# EAGLE design STM32F413CG (EAGLE 9.2.0)

## Sheet 1 of 3
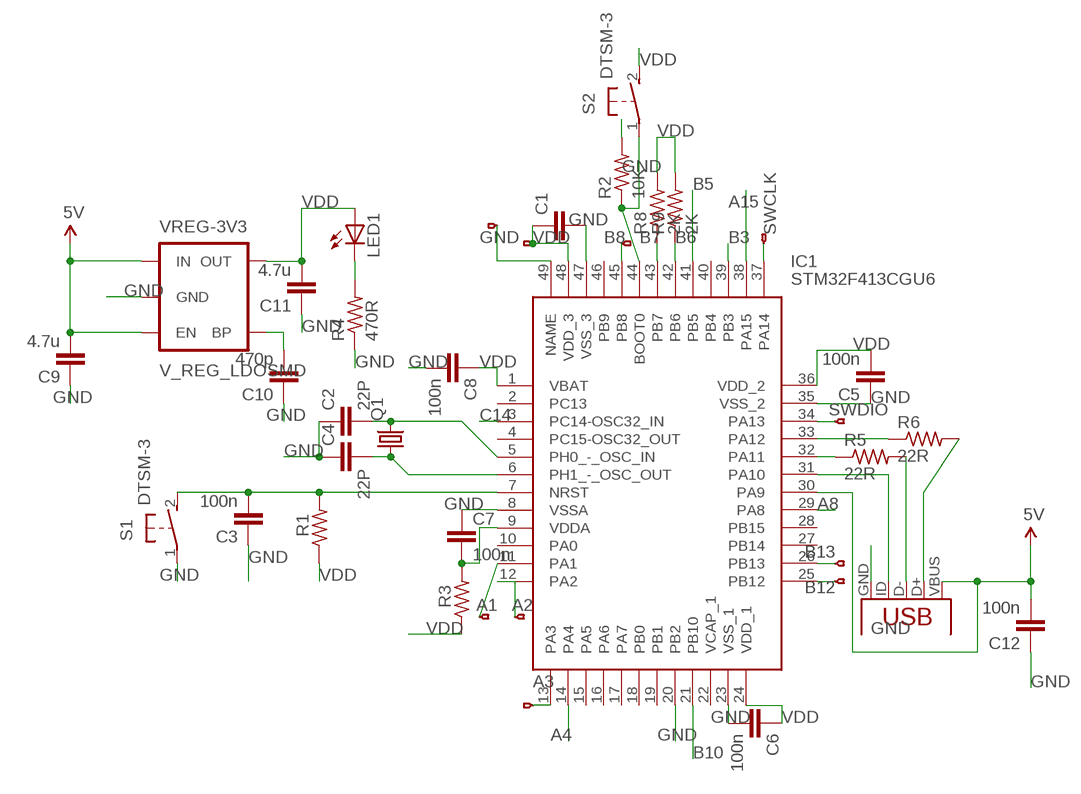
[diagram p0: schematic, sheet 1]

### Parts
C1  C2,5-3  [C2.5-3]
C2  22P  C2,5-3  [C2.5-3]
C3  100n  C2,5-3  [C2.5-3]
C4  22P  C2,5-3  [C2.5-3]
C5  100n  C2,5-3  [C2.5-3]
C6  100n  C2,5-3  [C2.5-3]
C7  100n  C2,5-3  [C2.5-3]
C8  100n  C2,5-3  [C2.5-3]
C9  4.7u  C2,5-3  [C2.5-3]
C10  470p  C2,5-3  [C2.5-3]
C11  4.7u  C2,5-3  [C2.5-3]
C12  100n  C2,5-3  [C2.5-3]
IC1  STM32F413CGU6  [QFN50P700X700X60-49N]
JP1  HEADERHOLE-HEADERHOLE  [1X1-HEADER-HOLE]
JP2  HEADERHOLE-HEADERHOLE  [1X1-HEADER-HOLE]
JP3  HEADERHOLE-HEADERHOLE  [1X1-HEADER-HOLE]
JP4  HEADERHOLE-HEADERHOLE  [1X1-HEADER-HOLE]
JP5  HEADERHOLE-HEADERHOLE  [1X1-HEADER-HOLE]
JP6  HEADERHOLE-HEADERHOLE  [1X1-HEADER-HOLE]
JP7  HEADERHOLE-HEADERHOLE  [1X1-HEADER-HOLE]
JP8  HEADERHOLE-HEADERHOLE  [1X1-HEADER-HOLE]
JP9  HEADERHOLE-HEADERHOLE  [1X1-HEADER-HOLE]
JP10  HEADERHOLE-HEADERHOLE  [1X1-HEADER-HOLE]
LED1  LED0603  [LED-0603]
Q1  CRYSTALHC49S  [HC49/S]
R1  R-US_0204/2V  [0204V]
R2  10K  R-US_0204/2V  [0204V]
R3  R-US_0204/2V  [0204V]
R4  470R  R-US_0204/2V  [0204V]
R5  22R  R-US_0204/2V  [0204V]
R6  22R  R-US_0204/2V  [0204V]
R8  2K  R-US_0204/2V  [0204V]
R9  2K  R-US_0204/2V  [0204V]
S1  DTSM-3  [DTSM-3]
S2  DTSM-3  [DTSM-3]
VREG-3V3  V_REG_LDOSMD  [SOT23-5]
X1  USB-MICROB-SMD  [USB-MICROB-SMD]

### Nets
5V: C9.2 C12.2 IC1.30(PA9) VREG-3V3.1(IN) VREG-3V3.3(EN) X1.VBUS
A1: IC1.11(PA1) JP8.1
A2: IC1.12(PA2) JP9.1
A3: IC1.13(PA3) JP10.1
A4: IC1.14(PA4) ; also sheet 2
A8: IC1.29(PA8) ; also sheet 2
A15: IC1.38(PA15) ; also sheet 3
B3: IC1.39(PB3) ; also sheet 3
B5: IC1.41(PB5) ; also sheet 3
B6: IC1.42(PB6) R9.1 ; also sheet 3
B7: IC1.43(PB7) R8.1 ; also sheet 3
B8: IC1.45(PB8) JP5.1
B10: IC1.21(PB10) ; also sheet 3
B12: IC1.25(PB12) JP7.1
B13: IC1.26(PB13) JP6.1
C14: IC1.3(PC14-OSC32_IN) ; also sheet 3
GND: C1.2 C2.1 C3.1 C4.1 C5.1 C6.2 C7.1 C8.2 C9.1 C10.1 C11.1 C12.1 IC1.8(VSSA) IC1.20(PB2) IC1.23(VSS_1) IC1.35(VSS_2) IC1.47(VSS_3) IC1.49(NAME) JP1.1 R2.2 R4.1 S1.1 VREG-3V3.2(GND) X1.GND ; also sheet 2,3
N$1: C2.2 IC1.5(PH0_-_OSC_IN) Q1.2
N$3: C3.2 IC1.7(NRST) R1.2 S1.2
N$4: C10.2 VREG-3V3.4(BP)
N$5: C7.2 IC1.9(VDDA) R3.2
N$6: LED1.C R4.2
N$7: R5.2 X1.D-
N$8: IC1.31(PA10) X1.ID
N$9: IC1.32(PA11) R5.1
N$10: R6.2 X1.D+
N$11: IC1.33(PA12) R6.1
N$13: IC1.44(BOOT0) R2.1 S2.1
N$19: C4.2 IC1.6(PH1_-_OSC_OUT) Q1.1
SWCLK: IC1.37(PA14) JP2.1
SWDIO: IC1.34(PA13) JP3.1
VDD: C1.1 C5.2 C6.1 C8.1 C11.2 IC1.1(VBAT) IC1.24(VDD_1) IC1.36(VDD_2) IC1.48(VDD_3) JP4.1 LED1.A R1.1 R3.1 R8.2 R9.2 S2.2 VREG-3V3.5(OUT) ; also sheet 2,3
Unconnected: IC1.2(PC13) IC1.4(PC15-OSC32_OUT) IC1.10(PA0) IC1.15(PA5) IC1.16(PA6) IC1.17(PA7) IC1.18(PB0) IC1.19(PB1) IC1.27(PB14) IC1.28(PB15) IC1.40(PB4) IC1.46(PB9) X1.MT1 X1.MT2 X1.MT3 X1.MT4

## Sheet 2 of 3
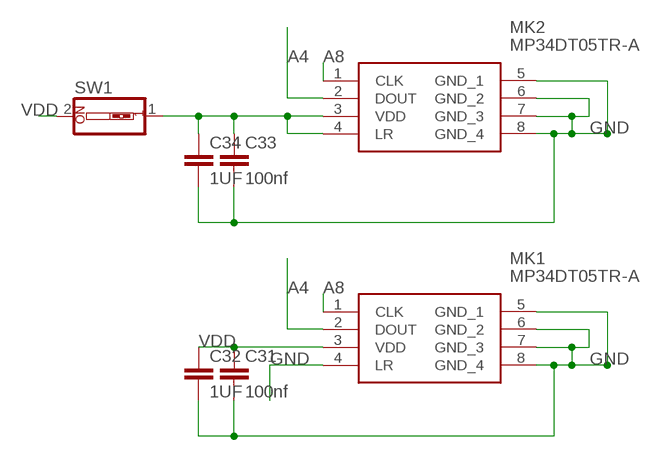
[diagram p1: schematic, sheet 2]

### Parts
C31  100nf  C2.5/2  [C2.5-2]
C32  1UF  C2.5/2  [C2.5-2]
C33  100nf  C2.5/2  [C2.5-2]
C34  1UF  C2.5/2  [C2.5-2]
MK1  MP34DT05TR-A  [MP34DT05TRA]
MK2  MP34DT05TR-A  [MP34DT05TRA]
SW1  SW_DIP-1  [EDG-01]

### Nets
A4: MK1.2(DOUT) MK2.2(DOUT) ; also sheet 1
A8: MK1.1(CLK) MK2.1(CLK) ; also sheet 1
GND: C31.2 C32.2 C33.2 C34.2 MK1.4(LR) MK1.5(GND_1) MK1.6(GND_2) MK1.7(GND_3) MK1.8(GND_4) MK2.5(GND_1) MK2.6(GND_2) MK2.7(GND_3) MK2.8(GND_4) ; also sheet 1,3
N$2: C33.1 C34.1 MK2.3(VDD) MK2.4(LR) SW1.1
VDD: C31.1 C32.1 MK1.3(VDD) SW1.2 ; also sheet 1,3

## Sheet 3 of 3
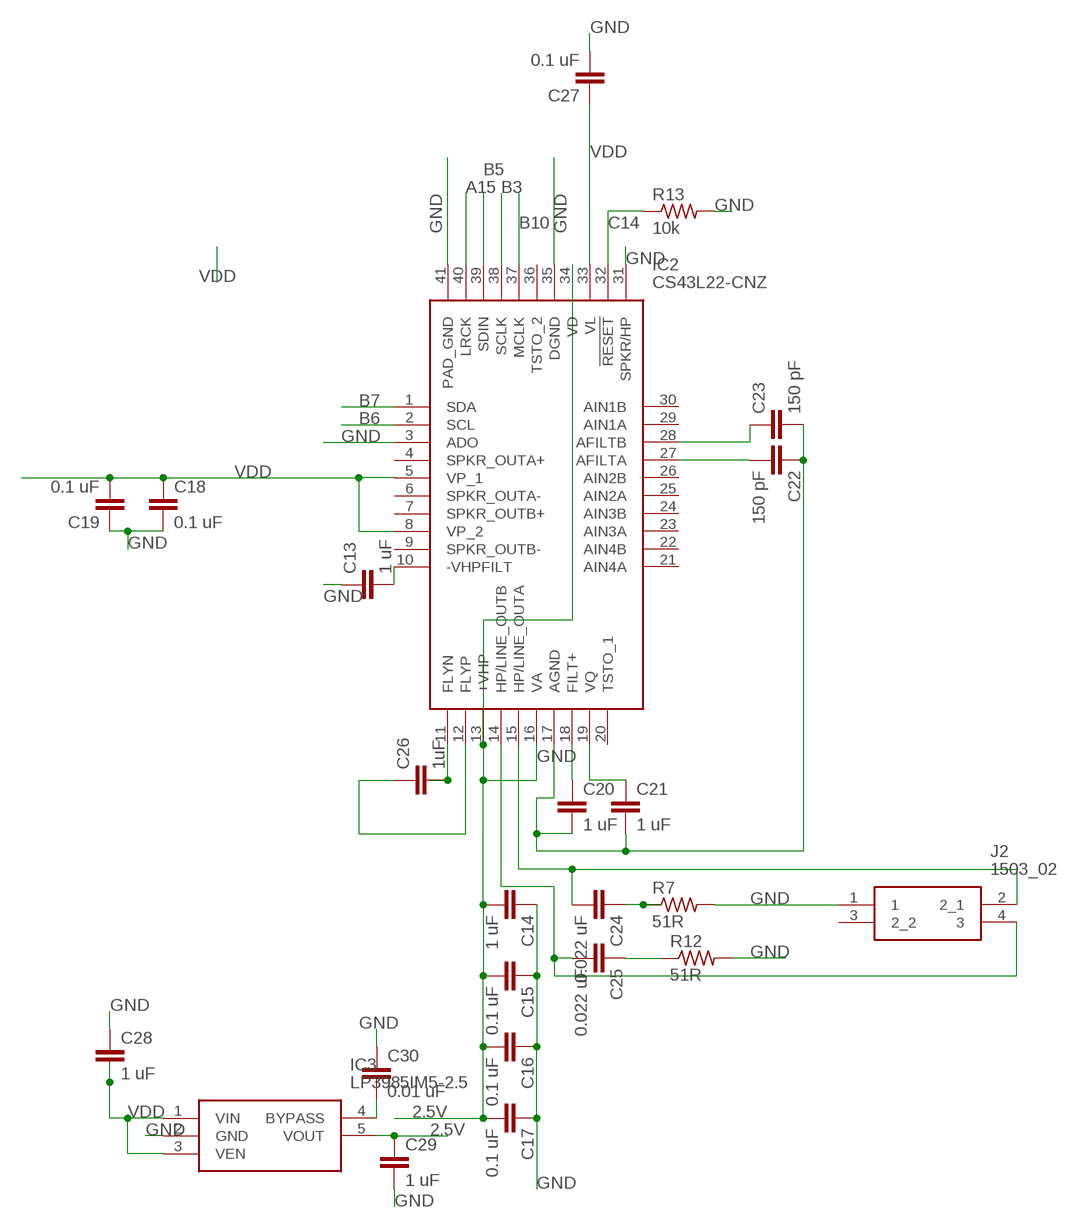
[diagram p2: schematic, sheet 3]

### Parts
C13  1 uF  CAPKIT  [CAP-PTH-SMALL-KIT]
C14  1 uF  CAPKIT  [CAP-PTH-SMALL-KIT]
C15  0.1 uF  CAPKIT  [CAP-PTH-SMALL-KIT]
C16  0.1 uF  CAPKIT  [CAP-PTH-SMALL-KIT]
C17  0.1 uF  CAPKIT  [CAP-PTH-SMALL-KIT]
C18  0.1 uF  CAPKIT  [CAP-PTH-SMALL-KIT]
C19  0.1 uF  CAPKIT  [CAP-PTH-SMALL-KIT]
C20  1 uF  CAPKIT  [CAP-PTH-SMALL-KIT]
C21  1 uF  CAPKIT  [CAP-PTH-SMALL-KIT]
C22  150 pF  CAPKIT  [CAP-PTH-SMALL-KIT]
C23  150 pF  CAPKIT  [CAP-PTH-SMALL-KIT]
C24  0.022 uF  CAPKIT  [CAP-PTH-SMALL-KIT]
C25  0.022 uF  CAPKIT  [CAP-PTH-SMALL-KIT]
C26  1uF  C2,5-3  [C2.5-3]
C27  0.1 uF  CAPKIT  [CAP-PTH-SMALL-KIT]
C28  1 uF  CAPKIT  [CAP-PTH-SMALL-KIT]
C29  1 uF  CAPKIT  [CAP-PTH-SMALL-KIT]
C30  0.01 uF  CAPKIT  [CAP-PTH-SMALL-KIT]
IC2  CS43L22-CNZ  [QFN50P600X600X100-41N]
IC3  LP3985IM5-2.5  [SOT95P300X120-5N]
J2  1503_02  [150302]
R7  51R  R-US_0204/2V  [0204V]
R12  51R  R-US_0204/2V  [0204V]
R13  10k  R-US_0204/2V  [0204V]

### Nets
2.5V: C14.2 C15.2 C16.2 C17.2 C29.1 IC2.13(+VHP) IC2.16(VA) IC2.34(VD) IC3.5(VOUT)
A15: IC2.40(LRCK) ; also sheet 1
B3: IC2.38(SCLK) ; also sheet 1
B5: IC2.39(SDIN) ; also sheet 1
B6: IC2.2(SCL) ; also sheet 1
B7: IC2.1(SDA) ; also sheet 1
B10: IC2.37(MCLK) ; also sheet 1
C14: IC2.32(!RESET) R13.1 ; also sheet 1
GND: C13.1 C14.1 C15.1 C16.1 C17.1 C18.2 C19.1 C20.2 C21.2 C22.1 C23.2 C27.2 C28.1 C29.2 C30.1 IC2.3(ADO) IC2.17(AGND) IC2.31(SPKR/HP) IC2.35(DGND) IC2.41(PAD_GND) IC3.2(GND) J2.1 R7.2 R12.2 R13.2 ; also sheet 1,2
N$25: C13.2 IC2.10(-VHPFILT)
N$26: C26.2 IC2.11(FLYN)
N$27: C26.1 IC2.12(FLYP)
N$28: C20.1 IC2.18(FILT+)
N$29: C21.1 IC2.19(VQ)
N$30: C22.2 IC2.27(AFILTA)
N$31: C23.1 IC2.28(AFILTB)
N$32: C24.2 IC2.15(HP/LINE_OUTA) J2.2(2_1)
N$33: C25.2 IC2.14(HP/LINE_OUTB) J2.4
N$34: C24.1 R7.1
N$35: C25.1 R12.1
N$38: C30.2 IC3.4(BYPASS)
VDD: C18.1 C19.2 C27.1 C28.2 IC2.5(VP_1) IC2.8(VP_2) IC2.33(VL) IC3.1(VIN) IC3.3(VEN) ; also sheet 1,2
Unconnected: IC2.4(SPKR_OUTA+) IC2.6(SPKR_OUTA-) IC2.7(SPKR_OUTB+) IC2.9(SPKR_OUTB-) IC2.20(TSTO_1) IC2.21(AIN4A) IC2.22(AIN4B) IC2.23(AIN3A) IC2.24(AIN3B) IC2.25(AIN2A) IC2.26(AIN2B) IC2.29(AIN1A) IC2.30(AIN1B) IC2.36(TSTO_2) J2.3(2_2)

## Power pins joined to a net without a drawn wire
VCAP_1: IC1.22(VCAP_1)

## Library data of the parts
C1-C12 C26 C31-C34 = capacitor-wima:C: CAPACITOR naming: grid - package width
C13-C25 C27-C30 = F405Pill:CAP: Capacitor Standard 0603 ceramic capacitor, and 0.1" leaded capacitor.
IC1 = STM32F413CGU6:STM32F413CGU6: STMICROELECTRONICS - STM32F413CGU6 - MCU, ARM CORTEX-M4, 100MHZ, UFQFPN-48 Source: Datasheet <http://www.st.com/content/ccc/resource/technical/document/datasheet/group3/f6/1d/4a/d9/f9/96/43/2a/DM00282249/files/DM00282249.pdf/jcr:content/translations/en.DM00282249.pdf>; DESCRIPTION: STMICROELECTRONICS - STM32F413CGU6 - MCU, ARM CORTEX-M4, 100MHZ, UFQFPN-48; HEIGHT: 0.6mm; MANUFACTURER_NAME: STMicroelectronics; MANUFACTURER_PART_NUMBER: STM32F413CGU6; MOUSER_PART_NUMBER: 511-STM32F413CGU6; MOUSER_PRICE-STOCK: https://www.mouser.com/Search/Refine.aspx?Keyword=511-STM32F413CGU6
IC2 = CS43L22-CNZ:CS43L22-CNZ: CS43L22-CNZ, Audio DAC 24 bit-, 96ksps Serial, 40-Pin QFN Source: Datasheet <https://d3uzseaevmutz1.cloudfront.net/pubs/proDatasheet/CS43L22_F2.pdf>; DESCRIPTION: CS43L22-CNZ, Audio DAC 24 bit-, 96ksps Serial, 40-Pin QFN; HEIGHT: 1mm; MANUFACTURER_NAME: Cirrus Logic; MANUFACTURER_PART_NUMBER: CS43L22-CNZ; MOUSER_PART_NUMBER: 777-CS43L22-CNZ; MOUSER_PRICE-STOCK: https://www.mouser.com/Search/Refine.aspx?Keyword=777-CS43L22-CNZ; RS_PART_NUMBER: 7165851P; RS_PRICE-STOCK: http://uk.rs-online.com/web/p/products/7165851P
IC3 = LP3985IM5-2.5:LP3985IM5-2.5: Low-Dropout CMOS Voltage Regulator Source: Datasheet; DESCRIPTION: Low-Dropout CMOS Voltage Regulator; HEIGHT: mm; MANUFACTURER_NAME: Texas Instruments; MANUFACTURER_PART_NUMBER: LP3985IM5-2.5; MOUSER_PART_NUMBER: 926-LP3985IM5-25; MOUSER_PRICE-STOCK: https://www.mouser.com/Search/Refine.aspx?Keyword=926-LP3985IM5-25; RS_PART_NUMBER: 4433167; RS_PRICE-STOCK: https://uk.rs-online.com/web/p/products/4433167
J2 = 1503_02:1503_02: LUMBERG - 1503 02 - CONNECTOR, RECEPTACLE, 3.5MM PHONO, 3WAY Source: Datasheet <http://www.farnell.com/datasheets/2047485.pdf>; DESCRIPTION: LUMBERG - 1503 02 - CONNECTOR, RECEPTACLE, 3.5MM PHONO, 3WAY; HEIGHT: 5mm; MANUFACTURER_NAME: LUMBERG; MANUFACTURER_PART_NUMBER: 1503 02
JP1-JP10 = F405Pill:HEADERHOLE
LED1 = F405Pill:LED: LEDs Standard schematic elements and footprints for 5mm, 3mm, 1206, and 0603 sized LEDs. 5mm - Spark Fun Electronics SKU : COM-00529 (and others)
MK1 MK2 = MP34DT05TR-A:MP34DT05TR-A: STMICROELECTRONICS - MP34DT05TR-A - MEMS MICROPHONE, 3.6V, HCLGA-4 Source: Datasheet <http://www.st.com/content/ccc/resource/technical/document/datasheet/group3/c7/90/d3/f6/b7/e7/40/c8/DM00415595/files/DM00415595.pdf/jcr:content/translations/en.DM00415595.pdf>; DESCRIPTION: STMICROELECTRONICS - MP34DT05TR-A - MEMS MICROPHONE, 3.6V, HCLGA-4; HEIGHT: 1mm; MANUFACTURER_NAME: STMicroelectronics; MANUFACTURER_PART_NUMBER: MP34DT05TR-A; MOUSER_PART_NUMBER: 511-MP34DT05TR-A; MOUSER_PRICE-STOCK: https://www.mouser.com/Search/Refine.aspx?Keyword=511-MP34DT05TR-A
Q1 = crystal:CRYSTAL: CRYSTAL; OC_FARNELL: 1667008; OC_NEWARK: unknown
R1-R9 R12 R13 = rcl:R-US_: RESISTOR, American symbol; SPICEPREFIX: R
S1 S2 = switch-tact:DTSM-3
SW1 = special:SW_DIP-1: DIP SWITCH
VREG-3V3 = F405Pill:V_REG_LDO: Voltage Regulator LDO Standard 150mA LDO voltage regulator in SOT-23 layout. Micrel part MIC5205. BP (by-pass) pin is used to lower output noise with 470pF cap.
X1 = F405Pill:USB: USB Connectors USB-B-PTH is fully proven SKU : PRT-00139 USB-miniB is fully proven SKU : PRT-00587 USB-A-PCB is untested. USB-A-H is throughly reviewed, but untested. Spark Fun Electronics SKU : PRT-00437 USB-B-SMT is throughly reviewed, but untested. Needs silkscreen touching up. USB-A-S has not been used/tested USB-MB-H has not been used/tested

## Net classes
0 default: width 0.254 mm, drill 0.35 mm

## Board
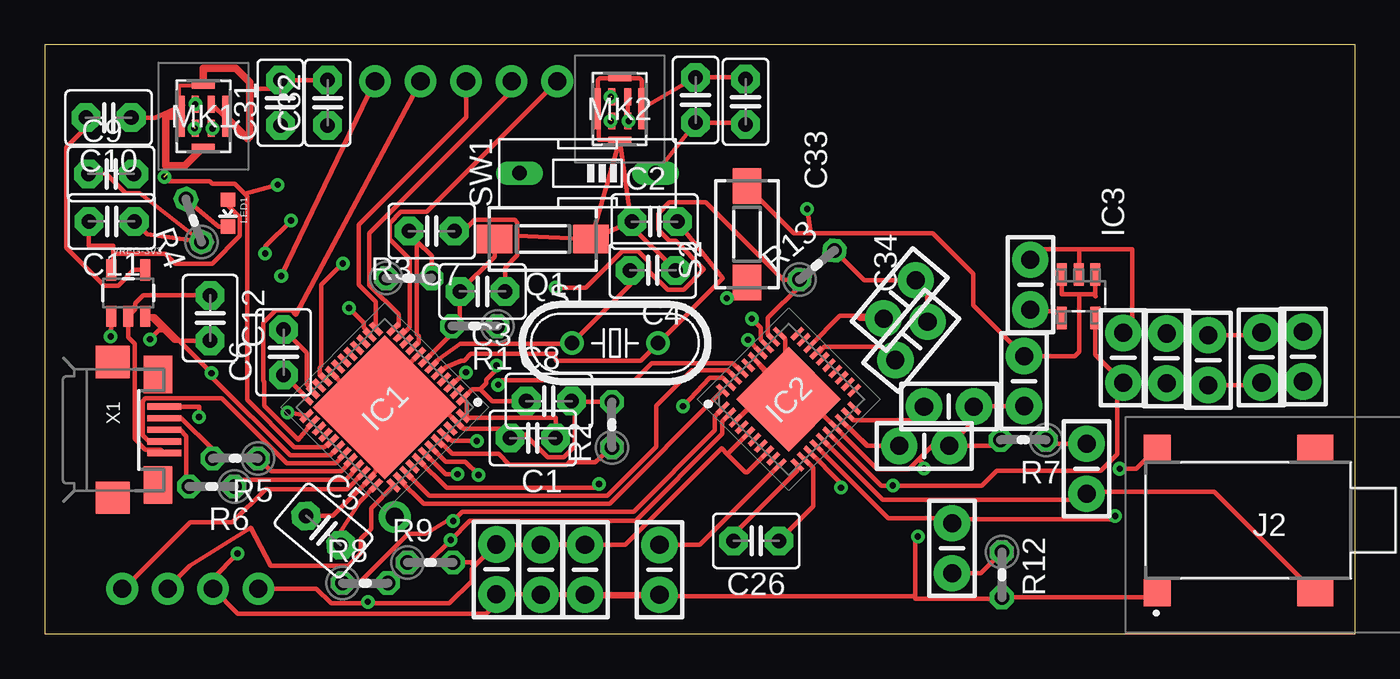
[diagram p3: board, top side]
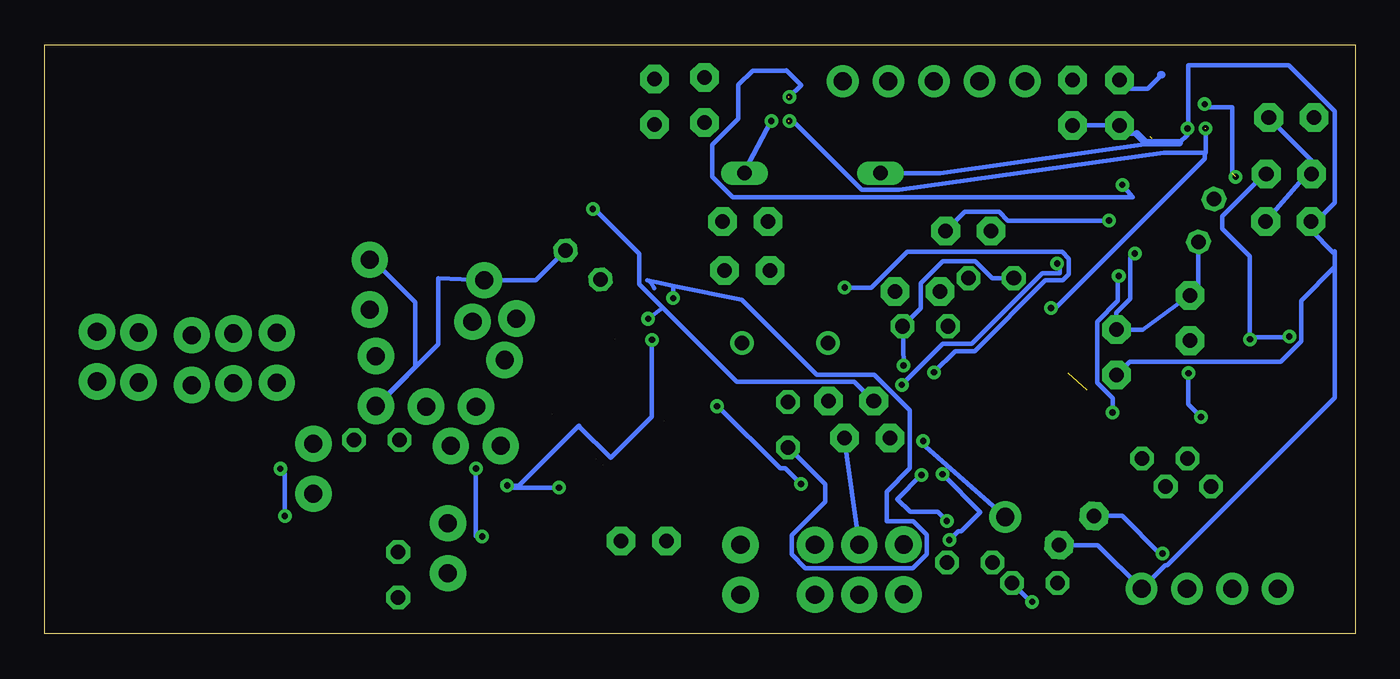
[diagram p4: board, bottom side, seen from below]

Size 73.4 x 33 mm. Coordinates in mm from the lower left corner, seen from the top.
Outline: 0,0 73.4,0 73.4,33 0,33 0,0
Copper layers (1*16): Top 0.035mm / dielectric 1.5mm / Bottom 0.035mm
Design rules "default": minimum track width 6mil, minimum drill 0.35mm, track to track 6mil, track to pad 6mil, pad to pad 6mil, via to via 6mil, smd to smd 6mil, copper to edge 40mil, drill to drill 6mil, minimum pad ring 10mil, minimum via ring 8mil, stop-mask expansion 4mil, vias tented up to drill 0mil, thermal gap 10mil

### Footprints (pad centres in the part's own frame; a part is rotated, then mirrored left to right if it is on the bottom)
C2.5-3 = drill 0.813 pad 1.6 octagon: 1 -1.27,0; 2 1.27,0
CAP-PTH-SMALL-KIT = drill 1.016 pad 2.032: 1 -1.397,0; 2 1.397,0
C2.5-2 = drill 0.813 pad 1.6 octagon: 1 -1.27,0; 2 1.27,0
QFN50P700X700X60-49N = smd 0.85 x 0.3: 1 -3.45,2.75; 2 -3.45,2.25; 3 -3.45,1.75; 4 -3.45,1.25; 5 -3.45,0.75; 6 -3.45,0.25; 7 -3.45,-0.25; 8 -3.45,-0.75; 9 -3.45,-1.25; 10 -3.45,-1.75; 11 -3.45,-2.25; 12 -3.45,-2.75; 25 3.45,-2.75; 26 3.45,-2.25; 27 3.45,-1.75; 28 3.45,-1.25; 29 3.45,-0.75; 30 3.45,-0.25; 31 3.45,0.25; 32 3.45,0.75; 33 3.45,1.25; 34 3.45,1.75; 35 3.45,2.25; 36 3.45,2.75 | smd 0.3 x 0.85: 13 -2.75,-3.45; 14 -2.25,-3.45; 15 -1.75,-3.45; 16 -1.25,-3.45; 17 -0.75,-3.45; 18 -0.25,-3.45; 19 0.25,-3.45; 20 0.75,-3.45; 21 1.25,-3.45; 22 1.75,-3.45; 23 2.25,-3.45; 24 2.75,-3.45; 37 2.75,3.45; 38 2.25,3.45; 39 1.75,3.45; 40 1.25,3.45; 41 0.75,3.45; 42 0.25,3.45; 43 -0.25,3.45; 44 -0.75,3.45; 45 -1.25,3.45; 46 -1.75,3.45; 47 -2.25,3.45; 48 -2.75,3.45 | smd 5.7 x 5.7: 49 0,0
QFN50P600X600X100-41N = smd 0.85 x 0.25: 1 -2.95,2.25; 2 -2.95,1.75; 3 -2.95,1.25; 4 -2.95,0.75; 5 -2.95,0.25; 6 -2.95,-0.25; 7 -2.95,-0.75; 8 -2.95,-1.25; 9 -2.95,-1.75; 10 -2.95,-2.25; 21 2.95,-2.25; 22 2.95,-1.75; 23 2.95,-1.25; 24 2.95,-0.75; 25 2.95,-0.25; 26 2.95,0.25; 27 2.95,0.75; 28 2.95,1.25; 29 2.95,1.75; 30 2.95,2.25 | smd 0.25 x 0.85: 11 -2.25,-2.95; 12 -1.75,-2.95; 13 -1.25,-2.95; 14 -0.75,-2.95; 15 -0.25,-2.95; 16 0.25,-2.95; 17 0.75,-2.95; 18 1.25,-2.95; 19 1.75,-2.95; 20 2.25,-2.95; 31 2.25,2.95; 32 1.75,2.95; 33 1.25,2.95; 34 0.75,2.95; 35 0.25,2.95; 36 -0.25,2.95; 37 -0.75,2.95; 38 -1.25,2.95; 39 -1.75,2.95; 40 -2.25,2.95 | smd 4.15 x 4.15: 41 0,0
SOT95P300X120-5N = smd 1.27 x 0.559: 1 -1.219,0.94; 2 -1.219,0; 3 -1.219,-0.94; 4 1.219,-0.94; 5 1.219,0.94
150302 = smd 1.5 x 1.5: 1 6.3,3.8; 4 6.3,-4.3 | smd 2 x 1.5: 2 -2.55,3.8; 3 -2.55,-4.3
1X1-HEADER-HOLE = drill 1.016 pad 1.778: 1 0,0
LED-0603 = smd 0.8 x 0.8: A 0,-0.75; C 0,0.75
MP34DT05TRA = smd 0.4 x 0.95: 1 -0.45,0.675; 2 -0.45,-0.675; 3 0.45,-0.675; 4 0.45,0.675 | smd 0.35 x 2.3: 5 -1.225,0; 6 1.225,0 | smd 1.3 x 0.35: 7 0,1.725; 8 0,-1.725
HC49/S = drill 0.813: 1 -2.413,0; 2 2.413,0
0204V = drill 0.813 octagon: 1 -1.27,0; 2 1.27,0
DTSM-3 = smd 2 x 1.6: 1 -2.7,0; 2 2.7,0
EDG-01 = drill 0.813 long: 1 0,-3.81; 2 0,3.81
SOT23-5 = smd 0.55 x 1.2: 1 -0.95,-1.3; 2 0,-1.3; 3 0.95,-1.3; 4 0.95,1.3; 5 -0.95,1.3
USB-MICROB-SMD = smd 0.35 x 1.9: D+ 0,2.9; D- -0.65,2.9; GND 1.3,2.9; ID 0.65,2.9; VBUS -1.3,2.9 | smd 1.8 x 1.9: MT1 -3.8,0; MT2 3.8,0 | smd 2.1 x 1.6: MT3 -3.1,2.55; MT4 3.1,2.55

### Placement (x,y rotation side)
C1  27.34,10.97 180 top
C2  34.16,23.09 0 top
C3  24.52,19.18 180 top
C4  34.06,20.36 180 top
C5  15.62,5.79 320 top
C6  13.38,15.77 90 top
C7  21.67,22.56 180 top
C8  28.24,13.04 0 top
C9  3.72,25.76 0 top
C10  3.58,28.91 180 top
C11  3.75,23.1 180 top
C12  9.27,17.69 270 top
C13  34.43,3.59 90 top
C14  70.47,15.53 270 top
C15  68.14,15.48 270 top
C16  65.16,15.33 270 top
C17  62.83,15.43 270 top
C18  27.78,3.59 270 top
C19  30.26,3.59 90 top
C20  49.26,10.53 0 top
C21  50.64,12.73 0 top
C22  48.54,16.41 230 top
C23  47.88,18.73 50 top
C24  58.35,9.25 270 top
C25  50.82,4.8 90 top
C26  39.85,5.21 180 top
C27  25.3,3.61 270 top
C28  54.85,14.16 90 top
C29  60.4,15.46 90 top
C30  55.2,19.56 270 top
C31  13.2,29.75 90 top
C32  15.85,29.75 90 top
C33  39.25,29.8 90 top
C34  36.45,29.9 90 top
IC1  19.05,12.7 225 top
IC2  41.66,13.14 45 top
IC3  57.9,18.91 270 top
J2  68.6,6.11 180 top
JP1  9.43,2.53 270 top
JP2  6.9,2.53 270 top
JP3  4.34,2.53 270 top
JP4  11.97,2.53 90 top
JP5  19.6,6.55 0 top
JP6  21.05,30.95 0 top
JP7  18.5,30.95 0 top
JP8  28.7,30.95 0 top
JP9  26.15,30.95 0 top
JP10  23.6,30.95 0 top
LED1  10.26,23.56 180 top
MK1  8.89,28.99 0 top
MK2  32.2,29.4 0 top
Q1  31.94,16.29 0 top
R1  24.08,17.23 180 top
R2  31.77,11.72 90 top
R3  20.4,19.92 0 top
R4  8.35,23.15 110 top
R5  10.68,9.83 180 top
R6  9.35,8.25 180 top
R7  54.8,10.86 180 top
R8  17.95,2.85 0 top
R9  21.6,4 0 top
R12  53.6,3.31 270 top
R13  43.25,20.66 40 top
S1  27.9,22.11 180 top
S2  39.33,22.38 90 top
SW1  30.4,25.8 90 top
VREG-3V3  4.68,19.09 0 top
X1  3.81,11.43 270 top

### Tracks (layer width: path | path; a pad name or v marks a point on that pad's centre or on a via)
2.5V  (via drill 0.35)
  Top 0.254: IC2.13 44.5,8.53 44.5,8.09 v44.6,8.19 | IC2.16 46.84,8.31 v47.5,8.31 52.48,8.31 53.31,9.15 59.14,9.15 60.06,10.07 60.06,13.73 C29.1 | C29.1 62.8,14.06 C17.2 65.06,14.03 C16.2 67.99,13.93 C15.2 70.52,14.08 | 70.95,13.91 70.78,14.08 70.52,14.08 | C29.1 58.84,15.62 IC3.5 | IC2.34 v39.39,16.47 | C14.2 70.52,14.08
  Bottom 0.254: v44.6,8.19 47.48,8.19 47.6,8.31 | 47.75,8.46 47.6,8.31 | 47.6,8.31 v47.5,8.31 46.85,8.31 43.5,11.66 43.45,11.66 43.45,11.61 41.7,9.86 39.39,12.17 v39.39,16.47
5V  (via drill 0.35)
  Top 0.254: IC1.30 | IC1.30 16,10.01 13.74,10.01 9.45,14.3 9.45,14.5 v9.35,14.6 6.95,17 | v8.65,12.15 8.65,12.73 X1.VBUS | 6.95,17 6.16,17.79 5.9,17.79 | 5.9,17.79 VREG-3V3.3 | C12.2 7.27,16.42 5.9,17.79 | VREG-3V3.1 3.73,17.08 3.7,17.05 v3.7,16.66 | v5.9,16.5 6.4,17 6.95,17
  Bottom 0.254: v9.35,14.6 9.35,12.85 v8.65,12.15 | v3.7,16.66 3.76,16.6 5.8,16.6 v5.9,16.5 5.9,21.15 7.45,22.7 7.45,23.4 5.09,25.76 C9.2
A1
  Top 0.254: JP8.1 21.39,23.64 19.95,23.64 19.32,23.01 19.32,22.11 20.44,20.99 20.44,17.18 19.81,16.54 IC1.11
A2
  Top 0.254: JP9.1 26.15,30.41 18.19,22.45 18.19,19.53 19.83,17.89 19.83,17.27 IC1.12
A3
  Top 0.254: JP10.1 23.6,28.94 17.58,22.92 17.58,19.56 18.55,18.59 IC1.13
A4  (via drill 0.35)  (2 unrouted)
  Top 0.254: IC1.14 18.2,16.83 17.87,17.16 17.87,17.43 v17.05,18.25
  Bottom 0.254: v8.39,28.32 8.39,26.95 8.44,26.95 | 8.44,26.95 8.44,26.61 11.8,23.25 16.8,18.25 v17.05,18.25 17.1,18.25 17.15,18.2 | v31.7,28.73 31.5,28.73 27.64,24.86 25.54,24.86 10.74,26.95 8.44,26.95
A8  (via drill 0.35)  (2 unrouted)
  Top 0.254: IC1.29 15.98,10.79 15.65,10.46 13.99,10.46 11.35,13.1 11.35,24.5 11.2,24.65 | 11.2,24.65 10.65,25.2 9.4,25.2 9.24,25.36 6.94,25.36 v6.7,25.6 | v13.05,25.15 11.2,24.65
  Bottom 0.254: MK1.1 8.28,29.5 6.9,29.5 6.9,25.8 | v31.7,30.07 31.04,30.74 31.86,31.56 31.86,31.55 33.75,31.55 34.56,30.74 34.56,28.86 36.01,27.4 36.01,25.61 34.85,24.45 12.47,24.45 v13.05,25.15
  other vias: 8.44,29.66
A15
  Top 0.254: IC1.38 19.9,8.62 21.23,7.29 31.64,7.29 IC2.40
B3
  Top 0.254: IC1.39 21.53,7.74 31.51,7.74 34.25,10.48 34.25,12.77 36.24,14.76 38.24,14.76 38.66,14.34 IC2.38 | IC1.39
B5  (via drill 0.35)
  Top 0.254: IC2.39 37.98,14.35 37.24,14.35 v35.75,12.75 | IC1.41 22.51,8.2 31.01,8.2 v31.05,8.4
  Bottom 0.254: v31.05,8.4 31.92,9.27 32.22,9.27 35.7,12.75 v35.75,12.75
B6  (via drill 0.35)
  Top 0.254: IC2.2 37.95,11.9 37.95,11.2 33.09,6.34 23.82,6.34 v22.74,5.26 21.48,4 R9.1 | v23.12,8.95 22.45,8.95 IC1.42
  Bottom 0.254: v23.12,8.95 21,6.83 22.07,5.75 22.25,5.75 v22.74,5.26
B7  (via drill 0.35)
  Top 0.254: IC2.1 37.53,12.2 37.53,11.39 32.98,6.84 23.39,6.84 v22.88,6.33 22.54,6.34 21.35,5.6 20.35,5.6 17.6,2.85 R8.1 | IC1.43 22.45,9.65 23.55,9.65 v24.3,8.9
  Bottom 0.254: v24.3,8.9 25.65,7.55 24.93,6.83 23.38,6.83 v22.88,6.33
B8  (via drill 0.35)
  Top 0.254: v24.2,10.8 24.19,10.81 22.81,10.81 22.47,11.14 IC1.45
  Bottom 0.254: JP5.1 24.3,10.7 v24.2,10.8
B10  (via drill 0.35)
  Top 0.254: IC1.21 15.68,14.21 | 15.68,14.21 | IC2.37 39.01,14.7 38.54,15.16 34,15.16 33.04,14.2 25.6,14.2 25.4,14 v25.4,13.95 | v16.7,20.75 15.5,19.55 15.5,15.03 15.39,14.92 15.39,14.49 15.68,14.21
  Bottom 0.254: v25.4,13.95 23.11,16.24 21.48,16.24 17.52,20.2 16.55,20.2 16.55,20.6 v16.7,20.75
B12  (via drill 0.35)
  Top 0.254: IC1.25 v13.6,12.4 | v13.25,20.05 JP7.1
  Bottom 0.254: v13.6,12.4 13.6,13.19 14.46,14.05 14.46,17.49 13.3,18.65 13.3,20.05 v13.25,20.05
B13
  Top 0.254: JP6.1 14.07,17.88 13.83,18.12 12.93,18.12 12.24,17.42 12.24,14.19 12.3,14.12 12.3,12.76 14.2,10.87 IC1.26
C14  (via drill 0.35)
  Top 0.254: IC1.3 v23.6,14.65 | IC2.32 40.5,16.78 40.5,17.7 42.28,19.48 R13.1 41.36,19.84 37.04,24.17 34.98,24.17 34.35,23.54 34.35,22.64 34.98,22.01 35.33,22.01 36.92,20.42 35.78,19.28 34.88,19.28 33.87,20.29 33.87,20.81 33.24,21.44 32.34,21.44 30.3,19.4 v28.6,19.4
  Bottom 0.254: v23.6,14.65 22.42,15.83 21.31,15.83 17.35,19.79 16.38,19.79 16.04,20.13 16.04,21.02 16.43,21.41 25.09,21.41 27.1,19.4 v28.6,19.4
GND  (via drill 0.35)  (4 unrouted)
  Top 0.254: C14.1 70.42,16.88 C15.1 67.99,16.73 C16.1 65.06,16.83 C17.1 60.43,16.83 C29.2 60.9,17.36 60.9,21.54 57.95,21.54 | 57.95,21.54 57.95,20.18 IC3.2 | 57.95,21.54 55.77,21.54 C30.1 | 50.69,10.57 52.04,11.91 C21.2 52.07,12.76 C28.1 | 50.69,10.57 C20.2 53.2,10.53 R7.2 | C19.1 C18.2 | J2.1 62.05,2.06 53.62,2.06 R12.2 53.68,1.96 48.75,1.96 48.75,2.11 | 48.75,2.11 34.51,2.11 | 34.51,2.11 30.34,2.11 C19.1 | 50.69,10.57 49.73,10.57 48.94,9.77 | 48.94,9.77 48.4,9.23 46.63,9.23 IC2.17 | 39.64,12.85 38.73,11.94 IC2.3 39.89,13.14 41.4,13.14 | 48.94,9.77 49.25,9.46 v49.25,9.26 | v48.9,5.46 48.75,5.31 48.75,2.11 | 25.8,2.21 34.45,2.21 C19.1 | 25.8,2.21 C27.2 | C6.2 14.69,15.73 14.69,13.98 15.02,13.65 IC1.23 | 11.49,30.5 11.51,30.52 12.7,30.52 C31.2 C32.2 | C5.1 16.14,6.61 IC1.35 18.2,8.77 18.53,9.1 18.53,9.43 19.05,9.95 19.05,12.4 | X1.GND 6.51,10.33 5.64,10.33 5.04,10.93 5.04,16.25 4.68,16.61 VREG-3V3.2 5.08,18.18 5.08,18.51 5.53,18.96 C12.1 | MK1.4 10.5,28.6 | C4.1 32.89,22.8 | 32.89,22.8 C2.1 S1.1 | IC1.20 17,13.69 17,13.5 17.8,12.7 18.6,12.7 | 18.6,12.7 IC1.49 19.05,12.4 | 25.8,2.21 24.73,1.14 10.82,1.14 JP1.1 9.43,3.13 v10.8,4.5 | 19.05,12.4 22.53,12.4 IC1.47 23.43,11.5 25.54,11.5 C1.2 26.25,11.15 26.9,11.15 28.16,9.89 29.06,9.89 29.69,10.52 29.69,13.04 C8.2 29.51,13.01 29.42,12.99 R2.2 | IC1.8 18.6,13.31 18.6,12.7 | IC2.17 | IC2.17 42.72,13.14 IC2.41 | 41.4,13.14 IC2.41 | 40.73,14.25 IC2.35 40.73,14.43 40.73,14.25 | 40.73,14.25 IC2.41 | 26.48,22.3 26.48,21.19 25.79,20.5 C3.1 | 26.48,22.3 26.48,23.03 26.32,23.19 24.08,23.19 23.45,22.56 C7.1 | S1.1 26.48,22.3 | 7.75,29.6 7.5,29.49 | 7.5,29.49 6.95,29.25
  Top 0.254: 6.95,29.25 6.18,28.91 C10.1 | C11.1 5.74,22.38 R4.1 5.32,24.68 4.54,24.68 3.46,25.76 C9.1 | C33.2 39.25,31.17 C34.2 MK2.6 33.43,31.02 33.32,31.12 MK2.7 31.08,31.12 30.97,31.02 MK2.5 31.02,29.35 31.02,27.68 MK2.8 | MK2.8 32.89,22.8 | S1.1 MK2.8 | MK1.7 7.5,30.7 7.5,29.49 | MK1.5 6.95,29.25 | C13.1 34.51,2.11 | C22.1 49.44,19.14 C23.2 45.9,19.8 R13.2 | v12.35,21.3 12.35,21.7 v13.8,23.15 | 41.16,13.38 41.27,13.27 | 41.27,13.27 41.4,13.14 | 41.49,16.5 41.49,13.49 41.27,13.27 | IC2.31 41.49,16.5 41.49,16.49
  Top 0.406: 11.38,27.73 10.5,28.6 MK1.6 | MK1.7 8.89,31.69 10.69,31.69 11.49,30.89 11.49,30.5 11.49,27.84 | MK1.8 7.86,26.23 6.79,26.23 6.79,28.99 MK1.5
  Bottom 0.254: C30.1 55.03,20.96 52.65,18.58 52.65,14.96 C28.1 54.8,12.76 51.35,16.21 51.35,19.91 C23.2 45.9,19.8 R13.2 | v49.25,9.26 49.25,5.46 v48.9,5.46 | 10.84,31.31 11.63,30.52 12.7,30.52 C31.2 | v10.8,4.5 10.95,4.5 13.06,6.61 C5.1 | R4.1 8.81,19.42 C12.1 11.9,17.04 C6.2 13.38,17.99 12.59,18.78 12.59,21.06 v12.35,21.3 | C11.1 2.75,25.72 C9.1 2.45,26.51 C10.1 | v13.8,23.15 19.46,23.15 19.95,23.64 21.86,23.64 C7.1
  Bottom 0.406: 10.89,31.31 10.84,31.31
N$1
  Top 0.254: IC1.5 22.12,14.61 22.45,14.94 23.32,15.31 23.5,15.31 23.87,15.68 28.55,15.68 28.65,15.31 33.37,15.31 Q1.2 37.97,19.91 C2.2
N$2  (via drill 0.35)
  Top 0.254: C33.1 39.25,28.63 C34.1 SW1.1 34.23,25.82 | v32.71,28.73 MK2.3 MK2.4
  Bottom 0.254: SW1.1 34.21,25.89 v32.71,28.73
N$3
  Top 0.254: IC1.7 22.81,16.81 R1.2 23.25,17.67 C3.2 25.2,21.13 S1.2
N$4
  Top 0.254: C10.2 2.31,28.35 1.22,27.26 1.22,21.63 3.34,19.51 4.12,19.51 5,20.39 VREG-3V3.4
N$5
  Top 0.254: IC1.9 20.66,16.02 20.94,16.31 20.94,16.69 20.85,16.77 20.85,22 | C7.2 20.45,22.51 20.45,22.4 20.85,22 | R3.2 21.67,21.18 20.85,22
N$6
  Top 0.254: LED1.C 9.76,22.81 R4.2
N$7
  Top 0.254: R5.2 9.41,10.33 7.66,12.08 X1.D-
N$8
  Top 0.254: IC1.31 16.79,10.03 16.3,9.55 13.56,9.55 9.93,13.18 5.64,13.18 5.48,13.02 5.48,11.14 5.84,10.78 7.01,10.78 X1.ID
N$9
  Top 0.254: IC1.32 17.14,9.63 16.61,9.1 12.68,9.1 R5.1
N$10
  Top 0.254: R6.2 7.94,8.39 7.94,11.07 7.58,11.43 X1.D+
N$11
  Top 0.254: R6.1 11.01,8.64 16.86,8.64 17.59,9.38 IC1.33
N$13  (via drill 0.35)
  Top 0.254: IC1.44 22.12,10.79 22.83,10.09 25.43,10.09 26.03,9.48 29.23,9.48 29.34,9.6 30.85,9.6 R2.1 | S2.1 38.45,18.8 v38.2,18.8
  Bottom 0.254: R2.1 29.69,8.37 29.69,7.39 31.55,5.52 31.55,4.45 30.8,3.69 24.78,3.69 24,4.47 24,5.54 24.76,6.3 26.24,6.3 26.24,7.97 24.94,9.27 24.94,12.54 26.93,14.53 30.18,14.53 34.35,18.7 38.12,19.48 | 38.12,19.48 39.11,19.69 39.44,19.76 39.65,19.8 39.45,19.7 39.25,19.35 | v38.2,18.8 38.2,19.41 38.12,19.48
N$19
  Top 0.254: IC1.6 22.1,15.4 23.28,16.24 29.48,16.24 Q1.1 32.79,19.55 C4.2
N$25
  Top 0.254: C13.2 36.69,4.99 IC2.10
N$26  (1 unrouted)
  Top 0.254: IC2.11 42.16,9.15 38.58,5.58 C26.2
N$27  (1 unrouted)
  Top 0.254: C26.1 43.05,7.14 43.05,9.31 42.54,9.82 | 42.54,9.82 | 42.54,9.82 IC2.12
N$28
  Top 0.254: C20.1 46.1,10.53 | 46.1,10.53 46.04,10.53 IC2.18 46.1,10.53
N$29  (1 unrouted)
  Top 0.254: IC2.19 44.98,12.28 45.28,11.98 48.49,11.98 C21.1
N$30
  Top 0.254: IC2.27 43.35,15.76 43.67,16.07 46.91,16.07 C22.2
N$31
  Top 0.254: 46.83,17.81 45.5,17.81 | 45.5,17.81 44.53,17.81 42.86,16.14 IC2.28 | C23.1 45.65,17.66 45.5,17.81
N$32
  Top 0.254: 46.37,8.07 46.94,7.5 58,7.5 C24.2 58.45,7.95 65.51,7.95 J2.2 | 46.37,8.07 IC2.15 46.37,8.07
N$33  (via drill 0.35)
  Top 0.254: v59.95,6.61 59.75,6.41 51.03,6.41 C25.2 50.87,6.25 50.87,6.49 47.25,6.49 IC2.14 | J2.4 61.14,9.25 v60.2,9.25
  Bottom 0.254: v59.95,6.61 59.95,9 v60.2,9.25
N$34
  Top 0.254: R7.1 56.25,11.02 56.25,10.65 C24.1
N$35
  Top 0.254: C25.1 52.42,3.4 R12.1
N$38
  Top 0.254: C30.2 55.3,18.06 56.59,18.06 IC3.4
SWCLK
  Top 0.254: IC1.37 18.28,7.05 18.28,5.9 17.71,5.33 17.71,4.51 17,3.81 12.65,3.81 11.55,5.95 8.13,3.81 6.9,2.58 JP2.1
SWDIO
  Top 0.254: IC1.34 16.94,8.11 12.38,8.11 10.52,6.25 8.15,6.25 4.43,2.53 JP3.1
VDD  (via drill 0.35)
  Top 0.152: MK1.3 9.34,28.12 9.39,28.12
  Top 0.254: C8.1 25.06,13.04 24.4,13.7 | 24.4,13.7 23.94,13.7 IC1.1 23.65,12.98 23.65,12.1 | IC1.24 14.67,13.21 C6.1 | IC1.48 23.54,12.1 23.65,12.1 | 23.65,12.1 28.61,12.1 C1.1 | IC1.36 17.68,7.44 16.59,5.74 C5.2 | VREG-3V3.5 3.83,20.49 3.83,21.3 | 3.83,21.3 3.83,21.75 2.48,21.75 C11.2 | LED1.A 10.26,24 10.94,23.33 10.94,22.29 9.38,20.74 7.31,20.74 6.75,21.3 3.83,21.3 | v9.4,28.3 v9.39,28.29 9.39,28.12 | 39.4,11.21 IC2.5 38.24,10.07 | IC2.8 39.35,9.06 39.25,9.06 38.24,10.07 | 38.24,10.07 37.91,10.4 32.52,5.01 25.5,5.01 | 25.5,5.01 C27.1 24.07,3.78 | C18.1 C19.2 27.87,5.08 | 28.05,5.26 27.87,5.08 | 27.87,5.08 C18.1 | 56.56,20.26 56.83,20.26 56.7,20.13 IC3.3 56.95,20.12 56.95,19.01 57.95,19.01 | IC3.1 58.84,18.92 | 58.85,18.91 58.84,18.92 | 58.84,18.92 58.75,19.01 57.95,19.01 | C28.2 53.91,16.5 | 57.95,19.01 57.95,15.81 57.7,15.56 C28.2 | JP4.1 15.22,2.53 16.04,1.71 18.01,1.71 | 24.07,3.78 23.91,3.62 23.91,2.96 22.66,1.71 18.01,1.71 | v18.1,1.8 18.01,1.71 | R9.2 23.85,4 24.07,3.78 | C18.1 25.5,5.01 | S2.2 41.96,22.45 42.9,22.45 | 42.9,22.45 49.74,22.45 52.01,20.18 52.01,18.4 C28.2 | 24.4,13.7 24.74,14.04 24.74,14.22 25.3,14.78 v25.3,15.03 | v42.7,23.8 42.9,22.45 | v39.6,17.65 40.09,17.16 40.09,16.48 IC2.33
  Bottom 0.254: 12.25,28 12.72,28 C31.1 C32.1 | 9.86,27.5 9.4,27.96 v9.4,28.3 9.35,28.35 9.35,31.86 3.73,31.86 1.14,29.27 1.14,24.14 2.48,22.8 | C5.2 14.41,4.97 JP4.1 10.66,3.84 10.53,3.84 1.14,13.23 1.14,20.55 | R8.2 18.17,1.8 v18.1,1.8 | C1.1 C18.1 | C11.2 2.48,22.8 | 2.48,22.8 2.48,22.6 1.23,21.35 1.14,21.44 1.14,20.55 | C6.1 12.64,15.24 4.19,15.24 3.04,16.39 3.04,18.65 1.14,20.55 | R3.1 20.34,19.92 21.28,20.86 23.1,20.86 24.33,19.63 24.33,18.25 R1.1 v25.3,15.03 | SW1.2 23.25,25.8 11.2,27.5 | C8.1 28.05,14.12 34.64,14.12 38.78,18.27 | 38.78,18.27 40.09,19.57 40.09,21.29 42.65,23.85 v42.7,23.8 | v39.6,17.65 38.78,18.27
  Bottom 0.406: 12.25,28 11.75,27.5 11.2,27.5 9.86,27.5